# EAGLE schematic 7seg_clock_ver3 (EAGLE 9.6.2)
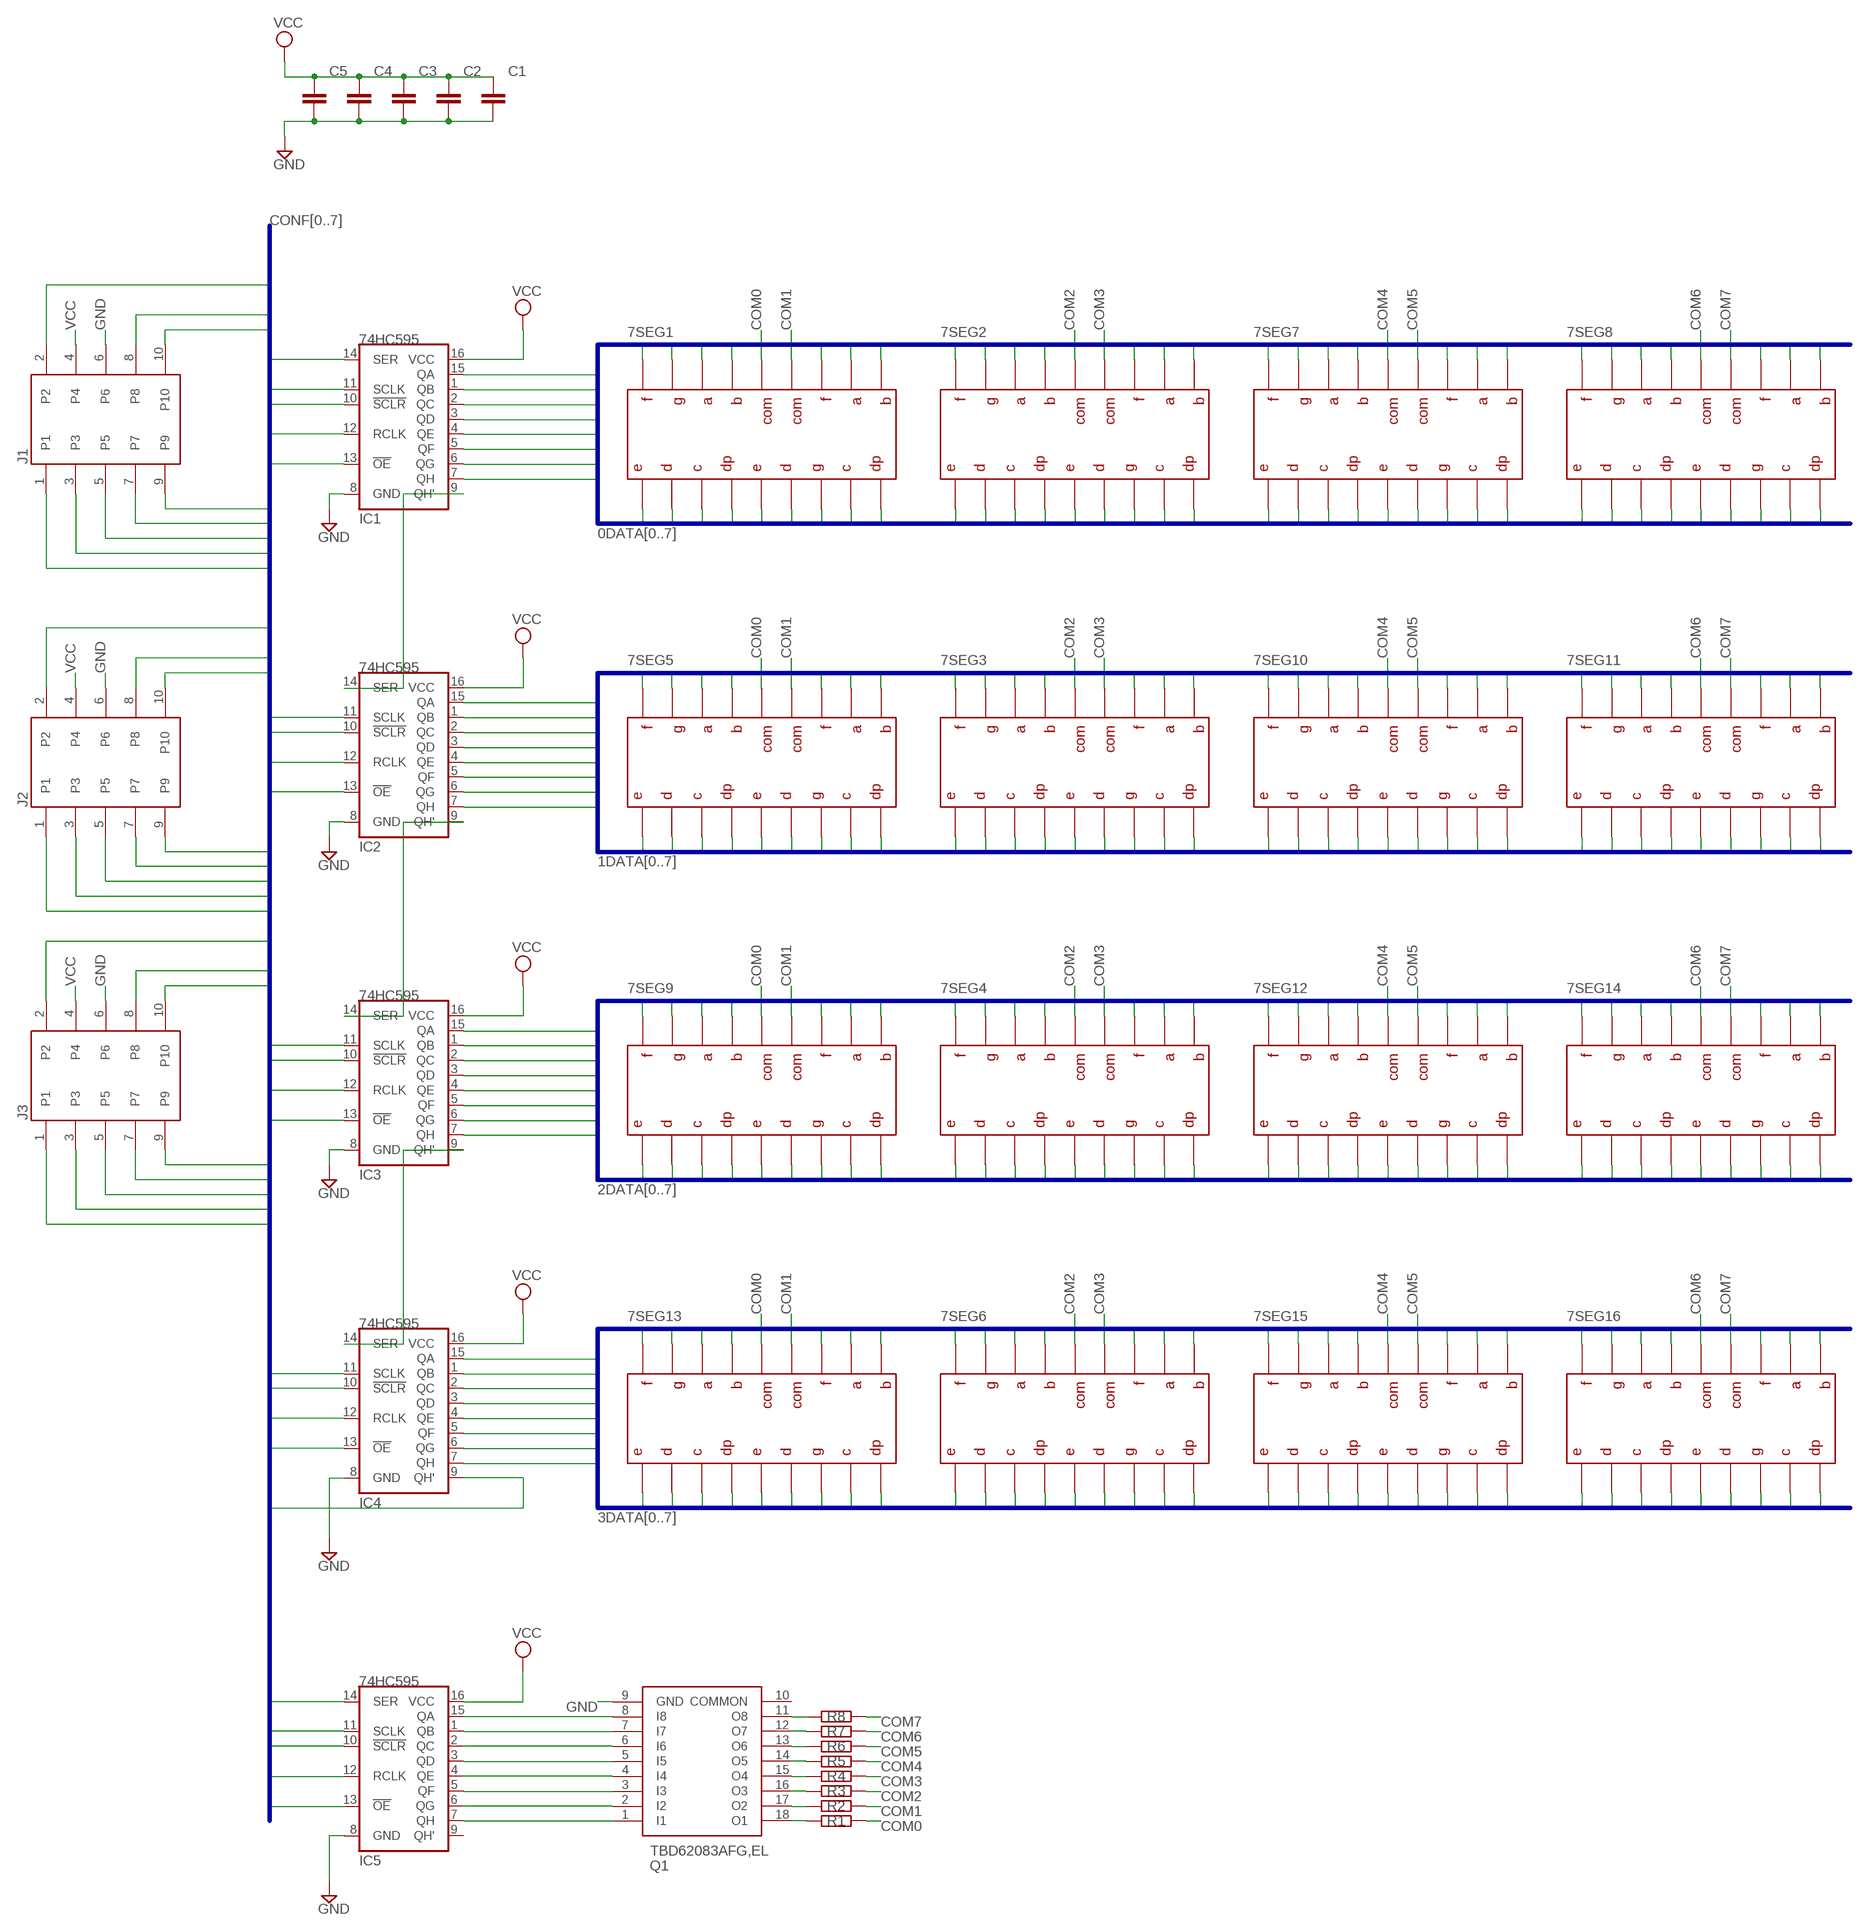
[diagram p0: schematic, sheet 1]

## Parts
7SEG1  SL-3264  [SL-3264]
7SEG2  SL-3264  [SL-3264]
7SEG3  SL-3264  [SL-3264]
7SEG4  SL-3264  [SL-3264]
7SEG5  SL-3264  [SL-3264]
7SEG6  SL-3264  [SL-3264]
7SEG7  SL-3264  [SL-3264]
7SEG8  SL-3264  [SL-3264]
7SEG9  SL-3264  [SL-3264]
7SEG10  SL-3264  [SL-3264]
7SEG11  SL-3264  [SL-3264]
7SEG12  SL-3264  [SL-3264]
7SEG13  SL-3264  [SL-3264]
7SEG14  SL-3264  [SL-3264]
7SEG15  SL-3264  [SL-3264]
7SEG16  SL-3264  [SL-3264]
C1  C_CHIP-0603(1608-METRIC)  [CAPC1608X85]
C2  C_CHIP-0603(1608-METRIC)  [CAPC1608X85]
C3  C_CHIP-0603(1608-METRIC)  [CAPC1608X85]
C4  C_CHIP-0603(1608-METRIC)  [CAPC1608X85]
C5  C_CHIP-0603(1608-METRIC)  [CAPC1608X85]
IC1  74HC595  [SO16]
IC2  74HC595  [SO16]
IC3  74HC595  [SO16]
IC4  74HC595  [SO16]
IC5  74HC595  [SO16]
J1  1241050-5  [TE_1241050-5]
J2  1241050-5  [TE_1241050-5]
J3  1241050-5  [TE_1241050-5]
Q1  TBD62083AFG,EL  [SOIC127P1030X245-18N]
R1  R_CHIP-0603(1608-METRIC)  [RESC1608X60]
R2  R_CHIP-0603(1608-METRIC)  [RESC1608X60]
R3  R_CHIP-0603(1608-METRIC)  [RESC1608X60]
R4  R_CHIP-0603(1608-METRIC)  [RESC1608X60]
R5  R_CHIP-0603(1608-METRIC)  [RESC1608X60]
R6  R_CHIP-0603(1608-METRIC)  [RESC1608X60]
R7  R_CHIP-0603(1608-METRIC)  [RESC1608X60]
R8  R_CHIP-0603(1608-METRIC)  [RESC1608X60]

## Nets
0DATA0: 7SEG1.P$10 7SEG1.P$15 7SEG2.P$10 7SEG2.P$15 7SEG7.P$10 7SEG7.P$15 7SEG8.P$10 7SEG8.P$15 IC1.15(QA)
0DATA1: 7SEG1.P$12 7SEG1.P$18 7SEG2.P$12 7SEG2.P$18 7SEG7.P$12 7SEG7.P$18 7SEG8.P$12 7SEG8.P$18 IC1.1(QB)
0DATA2: 7SEG1.P$7 7SEG1.P$17 7SEG2.P$7 7SEG2.P$17 7SEG7.P$7 7SEG7.P$17 7SEG8.P$7 7SEG8.P$17 IC1.2(QC)
0DATA3: 7SEG1.P$11 7SEG1.P$16 7SEG2.P$11 7SEG2.P$16 7SEG7.P$11 7SEG7.P$16 7SEG8.P$11 7SEG8.P$16 IC1.3(QD)
0DATA4: 7SEG1.P$4 7SEG1.P$9 7SEG2.P$4 7SEG2.P$9 7SEG7.P$4 7SEG7.P$9 7SEG8.P$4 7SEG8.P$9 IC1.4(QE)
0DATA5: 7SEG1.P$3 7SEG1.P$8 7SEG2.P$3 7SEG2.P$8 7SEG7.P$3 7SEG7.P$8 7SEG8.P$3 7SEG8.P$8 IC1.5(QF)
0DATA6: 7SEG1.P$2 7SEG1.P$6 7SEG2.P$2 7SEG2.P$6 7SEG7.P$2 7SEG7.P$6 7SEG8.P$2 7SEG8.P$6 IC1.6(QG)
0DATA7: 7SEG1.P$1 7SEG1.P$5 7SEG2.P$1 7SEG2.P$5 7SEG7.P$1 7SEG7.P$5 7SEG8.P$1 7SEG8.P$5 IC1.7(QH)
1DATA0: 7SEG3.P$10 7SEG3.P$15 7SEG5.P$10 7SEG5.P$15 7SEG10.P$10 7SEG10.P$15 7SEG11.P$10 7SEG11.P$15 IC2.15(QA)
1DATA1: 7SEG3.P$12 7SEG3.P$18 7SEG5.P$12 7SEG5.P$18 7SEG10.P$12 7SEG10.P$18 7SEG11.P$12 7SEG11.P$18 IC2.1(QB)
1DATA2: 7SEG3.P$7 7SEG3.P$17 7SEG5.P$7 7SEG5.P$17 7SEG10.P$7 7SEG10.P$17 7SEG11.P$7 7SEG11.P$17 IC2.2(QC)
1DATA3: 7SEG3.P$11 7SEG3.P$16 7SEG5.P$11 7SEG5.P$16 7SEG10.P$11 7SEG10.P$16 7SEG11.P$11 7SEG11.P$16 IC2.3(QD)
1DATA4: 7SEG3.P$4 7SEG3.P$9 7SEG5.P$4 7SEG5.P$9 7SEG10.P$4 7SEG10.P$9 7SEG11.P$4 7SEG11.P$9 IC2.4(QE)
1DATA5: 7SEG3.P$3 7SEG3.P$8 7SEG5.P$3 7SEG5.P$8 7SEG10.P$3 7SEG10.P$8 7SEG11.P$3 7SEG11.P$8 IC2.5(QF)
1DATA6: 7SEG3.P$2 7SEG3.P$6 7SEG5.P$2 7SEG5.P$6 7SEG10.P$2 7SEG10.P$6 7SEG11.P$2 7SEG11.P$6 IC2.6(QG)
1DATA7: 7SEG3.P$1 7SEG3.P$5 7SEG5.P$1 7SEG5.P$5 7SEG10.P$1 7SEG10.P$5 7SEG11.P$1 7SEG11.P$5 IC2.7(QH)
2DATA0: 7SEG4.P$10 7SEG4.P$15 7SEG9.P$10 7SEG9.P$15 7SEG12.P$10 7SEG12.P$15 7SEG14.P$10 7SEG14.P$15 IC3.15(QA)
2DATA1: 7SEG4.P$12 7SEG4.P$18 7SEG9.P$12 7SEG9.P$18 7SEG12.P$12 7SEG12.P$18 7SEG14.P$12 7SEG14.P$18 IC3.1(QB)
2DATA2: 7SEG4.P$7 7SEG4.P$17 7SEG9.P$7 7SEG9.P$17 7SEG12.P$7 7SEG12.P$17 7SEG14.P$7 7SEG14.P$17 IC3.2(QC)
2DATA3: 7SEG4.P$11 7SEG4.P$16 7SEG9.P$11 7SEG9.P$16 7SEG12.P$11 7SEG12.P$16 7SEG14.P$11 7SEG14.P$16 IC3.3(QD)
2DATA4: 7SEG4.P$4 7SEG4.P$9 7SEG9.P$4 7SEG9.P$9 7SEG12.P$4 7SEG12.P$9 7SEG14.P$4 7SEG14.P$9 IC3.4(QE)
2DATA5: 7SEG4.P$3 7SEG4.P$8 7SEG9.P$3 7SEG9.P$8 7SEG12.P$3 7SEG12.P$8 7SEG14.P$3 7SEG14.P$8 IC3.5(QF)
2DATA6: 7SEG4.P$2 7SEG4.P$6 7SEG9.P$2 7SEG9.P$6 7SEG12.P$2 7SEG12.P$6 7SEG14.P$2 7SEG14.P$6 IC3.6(QG)
2DATA7: 7SEG4.P$1 7SEG4.P$5 7SEG9.P$1 7SEG9.P$5 7SEG12.P$1 7SEG12.P$5 7SEG14.P$1 7SEG14.P$5 IC3.7(QH)
3DATA0: 7SEG6.P$10 7SEG6.P$15 7SEG13.P$10 7SEG13.P$15 7SEG15.P$10 7SEG15.P$15 7SEG16.P$10 7SEG16.P$15 IC4.15(QA)
3DATA1: 7SEG6.P$12 7SEG6.P$18 7SEG13.P$12 7SEG13.P$18 7SEG15.P$12 7SEG15.P$18 7SEG16.P$12 7SEG16.P$18 IC4.1(QB)
3DATA2: 7SEG6.P$7 7SEG6.P$17 7SEG13.P$7 7SEG13.P$17 7SEG15.P$7 7SEG15.P$17 7SEG16.P$7 7SEG16.P$17 IC4.2(QC)
3DATA3: 7SEG6.P$11 7SEG6.P$16 7SEG13.P$11 7SEG13.P$16 7SEG15.P$11 7SEG15.P$16 7SEG16.P$11 7SEG16.P$16 IC4.3(QD)
3DATA4: 7SEG6.P$4 7SEG6.P$9 7SEG13.P$4 7SEG13.P$9 7SEG15.P$4 7SEG15.P$9 7SEG16.P$4 7SEG16.P$9 IC4.4(QE)
3DATA5: 7SEG6.P$3 7SEG6.P$8 7SEG13.P$3 7SEG13.P$8 7SEG15.P$3 7SEG15.P$8 7SEG16.P$3 7SEG16.P$8 IC4.5(QF)
3DATA6: 7SEG6.P$2 7SEG6.P$6 7SEG13.P$2 7SEG13.P$6 7SEG15.P$2 7SEG15.P$6 7SEG16.P$2 7SEG16.P$6 IC4.6(QG)
3DATA7: 7SEG6.P$1 7SEG6.P$5 7SEG13.P$1 7SEG13.P$5 7SEG15.P$1 7SEG15.P$5 7SEG16.P$1 7SEG16.P$5 IC4.7(QH)
COM0 [sup]: 7SEG1.P$14 7SEG5.P$14 7SEG9.P$14 7SEG13.P$14 R1.2
COM1 [sup]: 7SEG1.P$13 7SEG5.P$13 7SEG9.P$13 7SEG13.P$13 R2.2
COM2 [sup]: 7SEG2.P$14 7SEG3.P$14 7SEG4.P$14 7SEG6.P$14 R3.2
COM3 [sup]: 7SEG2.P$13 7SEG3.P$13 7SEG4.P$13 7SEG6.P$13 R4.2
COM4 [sup]: 7SEG7.P$14 7SEG10.P$14 7SEG12.P$14 7SEG15.P$14 R5.2
COM5 [sup]: 7SEG7.P$13 7SEG10.P$13 7SEG12.P$13 7SEG15.P$13 R6.2
COM6 [sup]: 7SEG8.P$14 7SEG11.P$14 7SEG14.P$14 7SEG16.P$14 R7.2
COM7 [sup]: 7SEG8.P$13 7SEG11.P$13 7SEG14.P$13 7SEG16.P$13 R8.2
CONF0: IC1.14(SER) J1.1 J2.1 J3.1
CONF1: IC1.11(SCLK) IC2.11(SCLK) IC3.11(SCLK) IC4.11(SCLK) IC5.11(SCLK) J1.7 J2.7 J3.7
CONF2: IC1.10(!SCLR) IC2.10(!SCLR) IC3.10(!SCLR) IC4.10(!SCLR) IC5.10(!SCLR) J1.9 J2.9 J3.9
CONF3: IC1.12(RCLK) IC2.12(RCLK) IC3.12(RCLK) IC4.12(RCLK) J1.5 J2.5 J3.5
CONF4: IC1.13(!OE) IC2.13(!OE) IC3.13(!OE) IC4.13(!OE) IC5.13(!OE) J1.3 J2.3 J3.3
CONF5: IC4.9(QH') J1.10 J2.10 J3.10
CONF6: IC5.14(SER) J1.8 J2.8 J3.8
CONF7: IC5.12(RCLK) J1.2 J2.2 J3.2
GND [sup]: C1.2 C2.2 C3.2 C4.2 C5.2 IC1.8(GND) IC2.8(GND) IC3.8(GND) IC4.8(GND) IC5.8(GND) J1.6 J2.6 J3.6 Q1.9(GND)
N$1: IC1.9(QH') IC2.14(SER)
N$2: Q1.18(O1) R1.1
N$3: Q1.17(O2) R2.1
N$4: IC3.9(QH') IC4.14(SER)
N$5: Q1.16(O3) R3.1
N$6: IC5.7(QH) Q1.1(I1)
N$7: IC5.6(QG) Q1.2(I2)
N$8: IC5.5(QF) Q1.3(I3)
N$9: IC5.4(QE) Q1.4(I4)
N$10: Q1.15(O4) R4.1
N$11: Q1.14(O5) R5.1
N$12: IC5.3(QD) Q1.5(I5)
N$13: IC5.2(QC) Q1.6(I6)
N$14: IC5.1(QB) Q1.7(I7)
N$15: IC5.15(QA) Q1.8(I8)
N$16: Q1.13(O6) R6.1
N$17: Q1.12(O7) R7.1
N$18: Q1.11(O8) R8.1
N$19: IC2.9(QH') IC3.14(SER)
VCC [sup]: C1.1 C2.1 C3.1 C4.1 C5.1 IC1.16(VCC) IC2.16(VCC) IC3.16(VCC) IC4.16(VCC) IC5.16(VCC) J1.4 J2.4 J3.4
Unconnected: IC5.9(QH') Q1.10(COMMON)

## Buses
CONF[0..7]
3DATA[0..7]
2DATA[0..7]
1DATA[0..7]
0DATA[0..7]

## Library data of the parts
7SEG1-7SEG16 = SL3264:SL-3264; SL-3264: 三洋 7セグメントLED
C1-C5 = Capacitor:C: Capacitor - Generic; CATEGORY: Capacitor
IC1-IC5 = 74HC595N:74HC595: 8-bit SHIFT REGISTER, output latch Check availability <https://pricing.snapeda.com/parts/74HC595/Nexperia/view-part?ref=eda>; AVAILABILITY: In Stock; DESCRIPTION: Shift Register Single 8-Bit Serial to Serial/Parallel 16-Pin SSOP T/R; MF: Nexperia; MP: 74HC595; PACKAGE: None; PRICE: None; PURCHASE-URL: https://pricing.snapeda.com/search/part/74HC595/?ref=eda
J1-J3 = PinHead_2.54_2line:1241050-5: Conn Unshrouded Header HDR 10 POS 2.54mm Solder ST SMD Automotive T/R Check availability <https://pricing.snapeda.com/parts/1241050-5/TE%20Connectivity/view-part?ref=eda>; AVAILABILITY: In Stock; COMMENT: 1241050-5; DESCRIPTION: Conn Unshrouded Header HDR 10 POS 2.54mm Solder ST SMD Automotive Reel; EU_ROHS_COMPLIANCE: Compliant; MF: TE Connectivity; MP: 1241050-5; PACKAGE: None; PRICE: None; PURCHASE-URL: https://pricing.snapeda.com/search/part/1241050-5/?ref=eda
Q1 = TBD62083AFG_EL:TBD62083AFG,EL: Gate Drivers DMOS Transistor Array 7-CH, 50V/0.5A Source: Datasheet <https://componentsearchengine.com/Datasheets/1/TBD62083AFG,EL.pdf> Check availability <https://pricing.snapeda.com/parts/TBD62083AFG%2CEL/Toshiba%20Semiconductor/view-part?ref=eda>; AVAILABILITY: In Stock; DESCRIPTION: Power Switch/Driver 1:1 N-Channel 500mA 18-SOP; MF: Toshiba Semiconductor; MP: TBD62083AFG,EL; PACKAGE: SOIC-18 Toshiba Semiconductor and Storage; PRICE: None; PURCHASE-URL: https://pricing.snapeda.com/search/part/TBD62083AFG,EL/?ref=eda
R1-R8 = Resistor:R: Resistor Fixed - Generic; CATEGORY: Resistor; SUB-CATEGORY: Fixed

## Net classes
0 default: width 0.203 mm, clearance 0.203 mm
1 sup: width 0.762 mm, clearance 0.33 mm